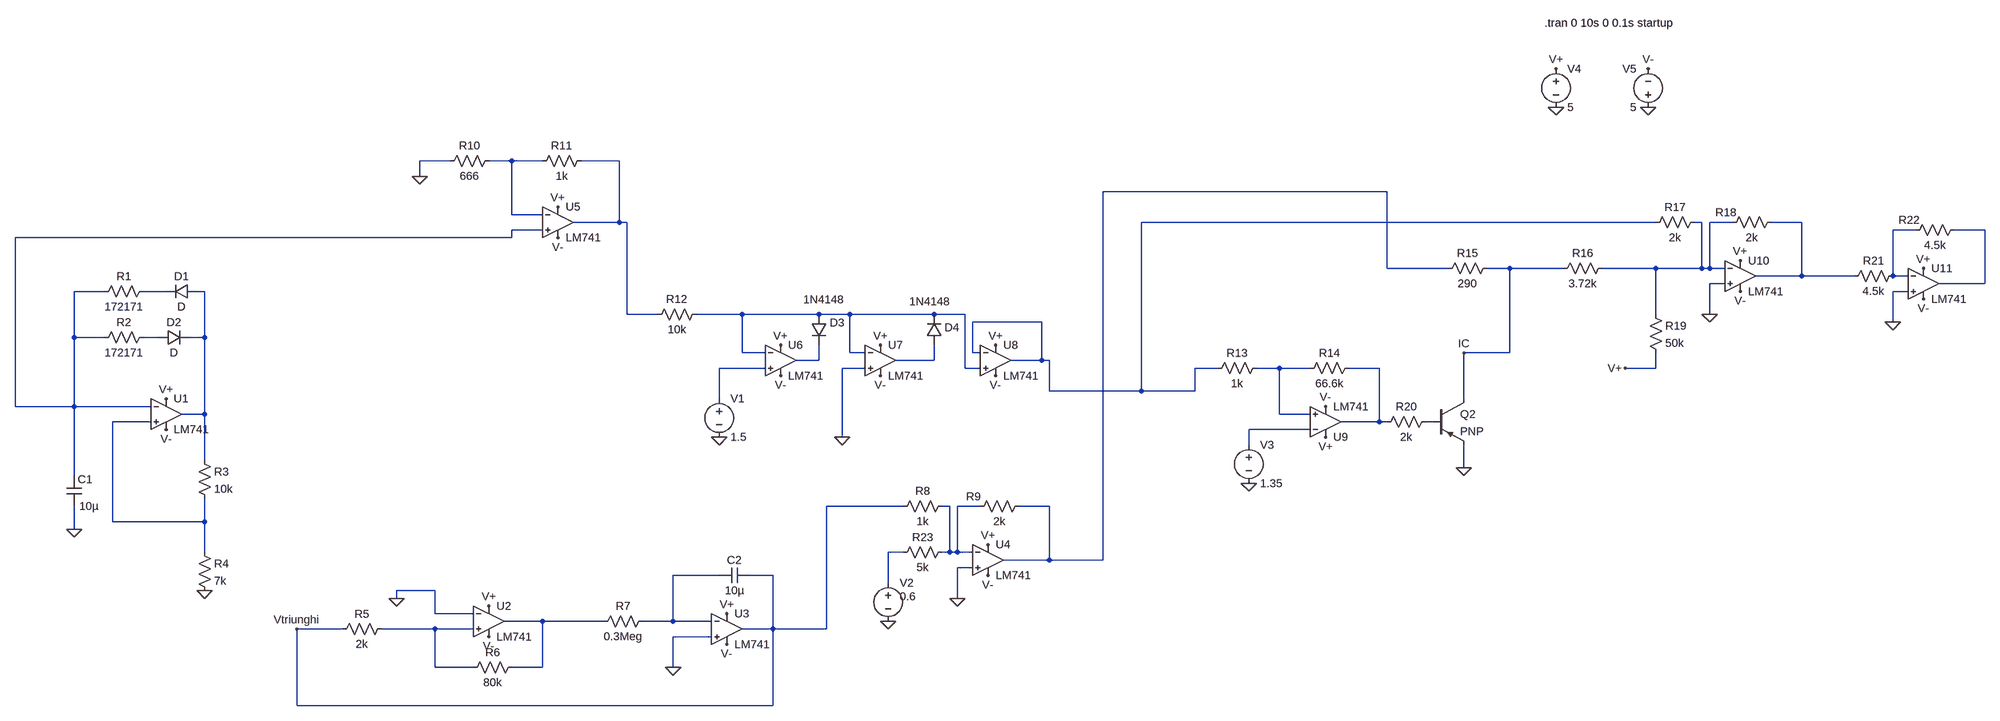
[diagram p0: schematic Envelope Generator.asc]
Envelope Generator.asc, the LTspice schematic file:
Version 4
SHEET 1 2436 3700
WIRE -2448 1168 -2512 1168
WIRE -2320 1168 -2368 1168
WIRE -2256 1168 -2320 1168
WIRE -2096 1168 -2176 1168
WIRE -2512 1200 -2512 1168
WIRE -480 1232 -1072 1232
WIRE -2320 1280 -2320 1168
WIRE -2256 1280 -2320 1280
WIRE -2096 1296 -2096 1168
WIRE -2096 1296 -2192 1296
WIRE -2080 1296 -2096 1296
WIRE 80 1296 -992 1296
WIRE 176 1296 160 1296
WIRE 240 1296 192 1296
WIRE 384 1296 320 1296
WIRE -2256 1312 -2320 1312
WIRE 640 1312 592 1312
WIRE 784 1312 720 1312
WIRE -2320 1328 -2320 1312
WIRE -2320 1328 -3376 1328
WIRE -480 1392 -480 1232
WIRE -352 1392 -480 1392
WIRE -224 1392 -272 1392
WIRE -112 1392 -224 1392
WIRE 80 1392 -32 1392
WIRE 176 1392 176 1296
WIRE 176 1392 80 1392
WIRE 192 1392 192 1296
WIRE 192 1392 176 1392
WIRE 224 1392 192 1392
WIRE 384 1408 384 1296
WIRE 384 1408 288 1408
WIRE 512 1408 384 1408
WIRE 592 1408 592 1312
WIRE 624 1408 592 1408
WIRE 224 1424 192 1424
WIRE 784 1424 784 1312
WIRE 784 1424 688 1424
WIRE -3168 1440 -3232 1440
WIRE -3040 1440 -3088 1440
WIRE -2960 1440 -2976 1440
WIRE 624 1440 592 1440
WIRE -2080 1488 -2080 1296
WIRE -2016 1488 -2080 1488
WIRE -1840 1488 -1936 1488
WIRE -1680 1488 -1840 1488
WIRE -1616 1488 -1680 1488
WIRE -1440 1488 -1616 1488
WIRE -1376 1488 -1440 1488
WIRE 80 1488 80 1392
WIRE 192 1488 192 1424
WIRE -1216 1504 -1360 1504
WIRE 592 1504 592 1440
WIRE -3232 1536 -3232 1440
WIRE -3168 1536 -3232 1536
WIRE -3056 1536 -3088 1536
WIRE -2960 1536 -2960 1440
WIRE -2960 1536 -2992 1536
WIRE -1840 1568 -1840 1488
WIRE -1792 1568 -1840 1568
WIRE -1616 1568 -1616 1488
WIRE -1584 1568 -1616 1568
WIRE -1360 1568 -1360 1504
WIRE -1344 1568 -1360 1568
WIRE -224 1568 -224 1392
WIRE -224 1568 -320 1568
WIRE -1680 1584 -1680 1552
WIRE -1680 1584 -1728 1584
WIRE -1440 1584 -1440 1552
WIRE -1440 1584 -1520 1584
WIRE -1216 1584 -1216 1504
WIRE -1216 1584 -1280 1584
WIRE -1200 1584 -1216 1584
WIRE -1792 1600 -1888 1600
WIRE -1584 1600 -1632 1600
WIRE -1376 1600 -1376 1488
WIRE -1344 1600 -1376 1600
WIRE -832 1600 -880 1600
WIRE -704 1600 -752 1600
WIRE -640 1600 -704 1600
WIRE -496 1600 -560 1600
WIRE 80 1600 80 1568
WIRE 80 1600 16 1600
WIRE -1200 1648 -1200 1584
WIRE -992 1648 -992 1296
WIRE -992 1648 -1200 1648
WIRE -880 1648 -880 1600
WIRE -880 1648 -992 1648
WIRE -1888 1664 -1888 1600
WIRE -320 1664 -320 1568
WIRE -3376 1680 -3376 1328
WIRE -3232 1680 -3232 1536
WIRE -3232 1680 -3376 1680
WIRE -3072 1680 -3232 1680
WIRE -2960 1696 -2960 1536
WIRE -2960 1696 -3008 1696
WIRE -704 1696 -704 1600
WIRE -640 1696 -704 1696
WIRE -3072 1712 -3152 1712
WIRE -496 1712 -496 1600
WIRE -496 1712 -576 1712
WIRE -480 1712 -496 1712
WIRE -384 1712 -400 1712
WIRE -640 1728 -768 1728
WIRE -1632 1744 -1632 1600
WIRE -768 1760 -768 1728
WIRE -2960 1792 -2960 1696
WIRE -320 1808 -320 1760
WIRE -3232 1824 -3232 1680
WIRE -1504 1888 -1664 1888
WIRE -1408 1888 -1424 1888
WIRE -1344 1888 -1392 1888
WIRE -1200 1888 -1264 1888
WIRE -3152 1920 -3152 1712
WIRE -2960 1920 -2960 1872
WIRE -2960 1920 -3152 1920
WIRE -3232 1936 -3232 1888
WIRE -2960 1984 -2960 1920
WIRE -1504 1984 -1536 1984
WIRE -1408 1984 -1408 1888
WIRE -1408 1984 -1424 1984
WIRE -1392 1984 -1392 1888
WIRE -1392 1984 -1408 1984
WIRE -1360 1984 -1392 1984
WIRE -1200 2000 -1200 1888
WIRE -1200 2000 -1296 2000
WIRE -1072 2000 -1072 1232
WIRE -1072 2000 -1200 2000
WIRE -1360 2016 -1392 2016
WIRE -1888 2032 -1984 2032
WIRE -1776 2032 -1824 2032
WIRE -1536 2048 -1536 1984
WIRE -2480 2064 -2560 2064
WIRE -2560 2080 -2560 2064
WIRE -1392 2080 -1392 2016
WIRE -2480 2112 -2480 2064
WIRE -2400 2112 -2480 2112
WIRE -2256 2128 -2336 2128
WIRE -2128 2128 -2256 2128
WIRE -1984 2128 -1984 2032
WIRE -1984 2128 -2048 2128
WIRE -1904 2128 -1984 2128
WIRE -2672 2144 -2768 2144
WIRE -2480 2144 -2592 2144
WIRE -2400 2144 -2480 2144
WIRE -1776 2144 -1776 2032
WIRE -1776 2144 -1840 2144
WIRE -1664 2144 -1664 1888
WIRE -1664 2144 -1776 2144
WIRE -1904 2160 -1984 2160
WIRE -2480 2224 -2480 2144
WIRE -2400 2224 -2480 2224
WIRE -2256 2224 -2256 2128
WIRE -2256 2224 -2320 2224
WIRE -1984 2224 -1984 2160
WIRE -2768 2304 -2768 2144
WIRE -1776 2304 -1776 2144
WIRE -1776 2304 -2768 2304
FLAG -1888 1744 0
FLAG -1632 1744 0
FLAG -1312 1552 V+
FLAG -1552 1552 V+
FLAG -1760 1552 V+
FLAG -1760 1616 V-
FLAG -1552 1616 V-
FLAG -1312 1616 V-
FLAG -128 1056 0
FLAG 64 1056 0
FLAG -128 976 V+
FLAG 64 976 V-
FLAG -2960 2064 0
FLAG -3040 1664 V+
FLAG -3040 1728 V-
FLAG -3232 1936 0
FLAG -1328 1968 V+
FLAG -1328 2032 V-
FLAG -1392 2080 0
FLAG -1984 2224 0
FLAG -1872 2112 V+
FLAG -1872 2176 V-
FLAG -2368 2096 V+
FLAG -2368 2160 V-
FLAG -2560 2080 0
FLAG -2768 2144 Vtriunghi
FLAG -2224 1264 V+
FLAG -2224 1328 V-
FLAG -2512 1200 0
FLAG -1536 2128 0
FLAG 256 1376 V+
FLAG 256 1440 V-
FLAG 192 1488 0
FLAG 656 1392 V+
FLAG 656 1456 V-
FLAG 592 1504 0
FLAG -608 1744 V+
FLAG -608 1680 V-
FLAG -768 1840 0
FLAG -320 1808 0
FLAG -320 1568 IC
FLAG 16 1600 V+
SYMBOL voltage -1888 1648 R0
WINDOW 123 0 0 Left 0
WINDOW 39 0 0 Left 0
SYMATTR InstName V1
SYMATTR Value 1.5
SYMBOL diode -1696 1488 R0
WINDOW 0 38 17 Left 2
WINDOW 3 -17 -31 Left 2
SYMATTR InstName D3
SYMATTR Value 1N4148
SYMBOL diode -1424 1552 R180
WINDOW 0 -36 37 Left 2
WINDOW 3 -17 91 Left 2
SYMATTR InstName D4
SYMATTR Value 1N4148
SYMBOL LM741 -1312 1520 R0
SYMATTR InstName U8
SYMBOL LM741 -1552 1520 R0
SYMATTR InstName U7
SYMBOL LM741 -1760 1520 R0
SYMATTR InstName U6
SYMBOL voltage -128 960 R0
WINDOW 123 0 0 Left 0
WINDOW 39 0 0 Left 0
SYMATTR InstName V4
SYMATTR Value 5
SYMBOL voltage 64 1072 R180
WINDOW 0 24 96 Left 2
WINDOW 3 24 16 Left 2
WINDOW 123 0 0 Left 0
WINDOW 39 0 0 Left 0
SYMATTR InstName V5
SYMATTR Value 5
SYMBOL LM741 -3040 1632 R0
SYMATTR InstName U1
SYMBOL res -2976 1776 R0
SYMATTR InstName R3
SYMATTR Value 10k
SYMBOL res -2976 1968 R0
SYMATTR InstName R4
SYMATTR Value 7k
SYMBOL res -3072 1520 R90
WINDOW 0 0 56 VBottom 2
WINDOW 3 32 56 VTop 2
SYMATTR InstName R2
SYMATTR Value 172171
SYMBOL cap -3248 1824 R0
WINDOW 3 27 64 Left 2
SYMATTR Value 10µ
SYMATTR InstName C1
SYMBOL res -3072 1424 R90
WINDOW 0 0 56 VBottom 2
WINDOW 3 32 56 VTop 2
SYMATTR InstName R1
SYMATTR Value 172171
SYMBOL diode -2976 1424 R90
WINDOW 0 0 32 VBottom 2
WINDOW 3 32 32 VTop 2
SYMATTR InstName D1
SYMBOL diode -3056 1552 R270
WINDOW 0 32 32 VTop 2
WINDOW 3 0 32 VBottom 2
SYMATTR InstName D2
SYMBOL LM741 -1328 1936 R0
SYMATTR InstName U4
SYMBOL res -1408 1968 R90
WINDOW 0 0 56 VBottom 2
WINDOW 3 32 56 VTop 2
SYMATTR InstName R23
SYMATTR Value 5k
SYMBOL res -1248 1872 R90
WINDOW 0 11 110 VBottom 2
WINDOW 3 32 56 VTop 2
SYMATTR InstName R9
SYMATTR Value 2k
SYMBOL res -2304 2208 R90
WINDOW 0 0 56 VBottom 2
WINDOW 3 32 56 VTop 2
SYMATTR InstName R6
SYMATTR Value 80k
SYMBOL res -2032 2112 R90
WINDOW 0 0 56 VBottom 2
WINDOW 3 32 56 VTop 2
SYMATTR InstName R7
SYMATTR Value 0.3Meg
SYMBOL cap -1824 2016 R90
WINDOW 0 0 32 VBottom 2
WINDOW 3 32 32 VTop 2
SYMATTR InstName C2
SYMATTR Value 10µ
SYMBOL res -2576 2128 R90
WINDOW 0 0 56 VBottom 2
WINDOW 3 32 56 VTop 2
SYMATTR InstName R5
SYMATTR Value 2k
SYMBOL LM741 -2368 2064 R0
SYMATTR InstName U2
SYMBOL LM741 -1872 2080 R0
SYMATTR InstName U3
SYMBOL LM741 -2224 1232 R0
SYMATTR InstName U5
SYMBOL res -2160 1152 R90
WINDOW 0 0 56 VBottom 2
WINDOW 3 32 56 VTop 2
SYMATTR InstName R11
SYMATTR Value 1k
SYMBOL res -2352 1152 R90
WINDOW 0 0 56 VBottom 2
WINDOW 3 32 56 VTop 2
SYMATTR InstName R10
SYMATTR Value 666
SYMBOL res -1920 1472 R90
WINDOW 0 0 56 VBottom 2
WINDOW 3 32 56 VTop 2
SYMATTR InstName R12
SYMATTR Value 10k
SYMBOL res -1408 1872 R90
WINDOW 0 0 56 VBottom 2
WINDOW 3 32 56 VTop 2
SYMATTR InstName R8
SYMATTR Value 1k
SYMBOL voltage -1536 2032 R0
WINDOW 3 24 44 Left 2
WINDOW 123 0 0 Left 0
WINDOW 39 0 0 Left 0
SYMATTR Value 0.6
SYMATTR InstName V2
SYMBOL LM741 256 1344 R0
SYMATTR InstName U10
SYMBOL res 336 1280 R90
WINDOW 0 11 110 VBottom 2
WINDOW 3 32 56 VTop 2
SYMATTR InstName R18
SYMATTR Value 2k
SYMBOL res 176 1280 R90
WINDOW 0 0 56 VBottom 2
WINDOW 3 32 56 VTop 2
SYMATTR InstName R17
SYMATTR Value 2k
SYMBOL LM741 656 1360 R0
SYMATTR InstName U11
SYMBOL res 736 1296 R90
WINDOW 0 11 110 VBottom 2
WINDOW 3 32 56 VTop 2
SYMATTR InstName R22
SYMATTR Value 4.5k
SYMBOL res 608 1392 R90
WINDOW 0 0 56 VBottom 2
WINDOW 3 32 56 VTop 2
SYMATTR InstName R21
SYMATTR Value 4.5k
SYMBOL LM741 -608 1776 M180
SYMATTR InstName U9
SYMBOL res -544 1584 R90
WINDOW 0 0 56 VBottom 2
WINDOW 3 32 56 VTop 2
SYMATTR InstName R14
SYMATTR Value 66.6k
SYMBOL res -736 1584 R90
WINDOW 0 0 56 VBottom 2
WINDOW 3 32 56 VTop 2
SYMATTR InstName R13
SYMATTR Value 1k
SYMBOL res -16 1376 R90
WINDOW 0 0 56 VBottom 2
WINDOW 3 32 56 VTop 2
SYMATTR InstName R16
SYMATTR Value 3.72k
SYMBOL res -256 1376 R90
WINDOW 0 0 56 VBottom 2
WINDOW 3 32 56 VTop 2
SYMATTR InstName R15
SYMATTR Value 290
SYMBOL voltage -768 1744 R0
WINDOW 123 0 0 Left 0
WINDOW 39 0 0 Left 0
SYMATTR InstName V3
SYMATTR Value 1.35
SYMBOL pnp -384 1664 R0
SYMATTR InstName Q2
SYMBOL res -384 1696 R90
WINDOW 0 0 56 VBottom 2
WINDOW 3 32 56 VTop 2
SYMATTR InstName R20
SYMATTR Value 2k
SYMBOL res 64 1472 R0
SYMATTR InstName R19
SYMATTR Value 50k
TEXT -152 880 Left 2 !.tran 0 10s 0 0.1s startup

The netlist it stands for:
* Envelope Generator.asc
V1 N016 0 1.5
D3 N012 N014 1N4148
D4 N015 N012 1N4148
XU8 N012 N004 V+ V- N004 LM741  ; pins In+ In- V+ V- OUT
XU7 0 N012 V+ V- N015 LM741  ; pins In+ In- V+ V- OUT
XU6 N016 N012 V+ V- N014 LM741  ; pins In+ In- V+ V- OUT
V4 V+ 0 5
V5 0 V- 5
XU1 N019 N007 V+ V- N011 LM741  ; pins In+ In- V+ V- OUT
R3 N011 N019 10k
R4 N019 0 7k
R2 N013 N007 172171
C1 N007 0 10µ
R1 N010 N007 172171
D1 N011 N010 D
D2 N013 N011 D
XU4 0 N022 V+ V- N003 LM741  ; pins In+ In- V+ V- OUT
R23 N022 N023 5k
R9 N003 N022 2k
R6 N025 N026 80k
R7 N024 N025 0.3Meg
C2 Vtriunghi N024 10µ
R5 N026 Vtriunghi 2k
XU2 N026 0 V+ V- N025 LM741  ; pins In+ In- V+ V- OUT
XU3 0 N024 V+ V- Vtriunghi LM741  ; pins In+ In- V+ V- OUT
XU5 N007 N001 V+ V- N002 LM741  ; pins In+ In- V+ V- OUT
R11 N002 N001 1k
R10 N001 0 666
R12 N012 N002 10k
R8 N022 Vtriunghi 1k
V2 N023 0 0.6
XU10 0 N005 V+ V- N006 LM741  ; pins In+ In- V+ V- OUT
R18 N006 N005 2k
R17 N005 N004 2k
XU11 0 N008 V+ V- N009 LM741  ; pins In+ In- V+ V- OUT
R22 N009 N008 4.5k
R21 N008 N006 4.5k
XU9 N017 N021 V+ V- N018 LM741  ; pins In+ In- V+ V- OUT
R14 N018 N017 66.6k
R13 N017 N004 1k
R16 N005 IC 3.72k
R15 IC N003 290
V3 N021 0 1.35
Q2 IC N020 0 0 PNP
R20 N020 N018 2k
R19 N005 V+ 50k
.model D D
.lib standard.dio
.model NPN NPN
.model PNP PNP
.lib standard.bjt
.tran 0 10s 0 0.1s startup
.lib LM741.lib
.backanno
.end